# EasyEDA Pro project Dennis_Re.eprj, schematic 键盘主控板

## Sheets
1 c8t6: Create Date: 2023-03-26; Page Name: c8t6; Project Name: Dennis_Re; Schematic Name: 键盘主控板; Update Date: 2023-03-26; Company: 嘉立创EDA; Page Size: A4; Version: V1.0
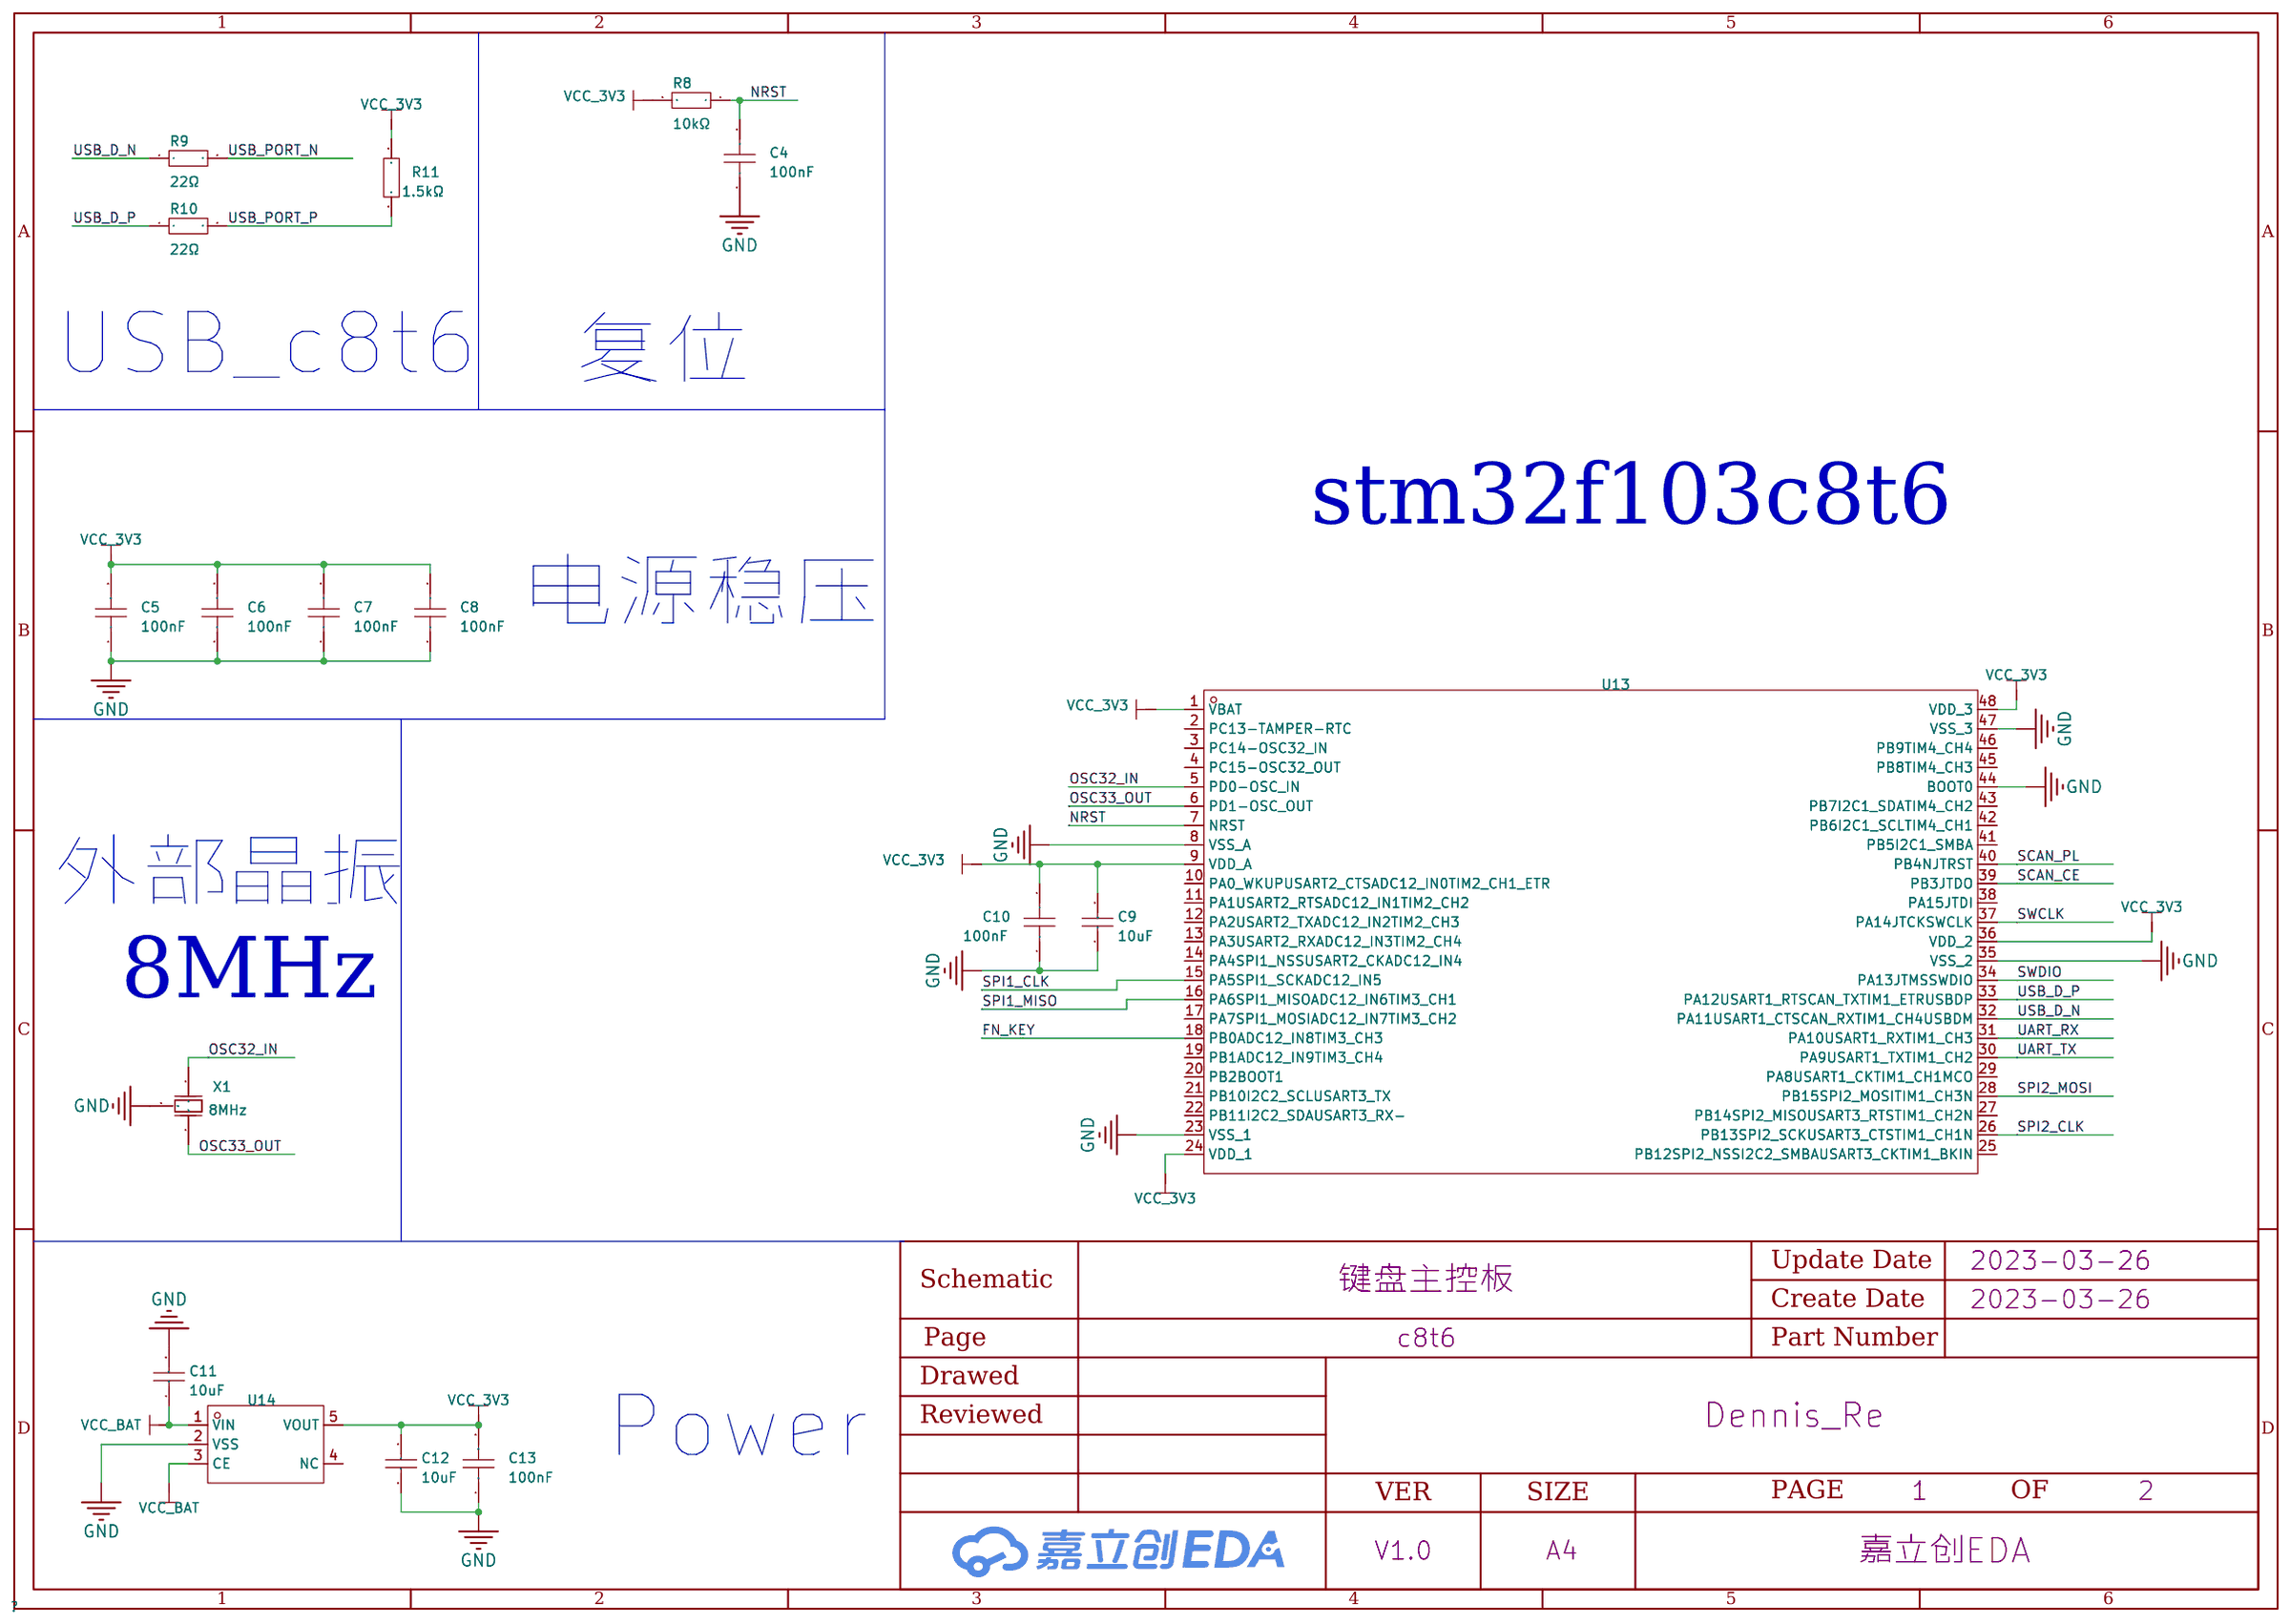
[diagram p0: c8t6]
2 hub: Page Name: hub; Update Date: 2023-03-28
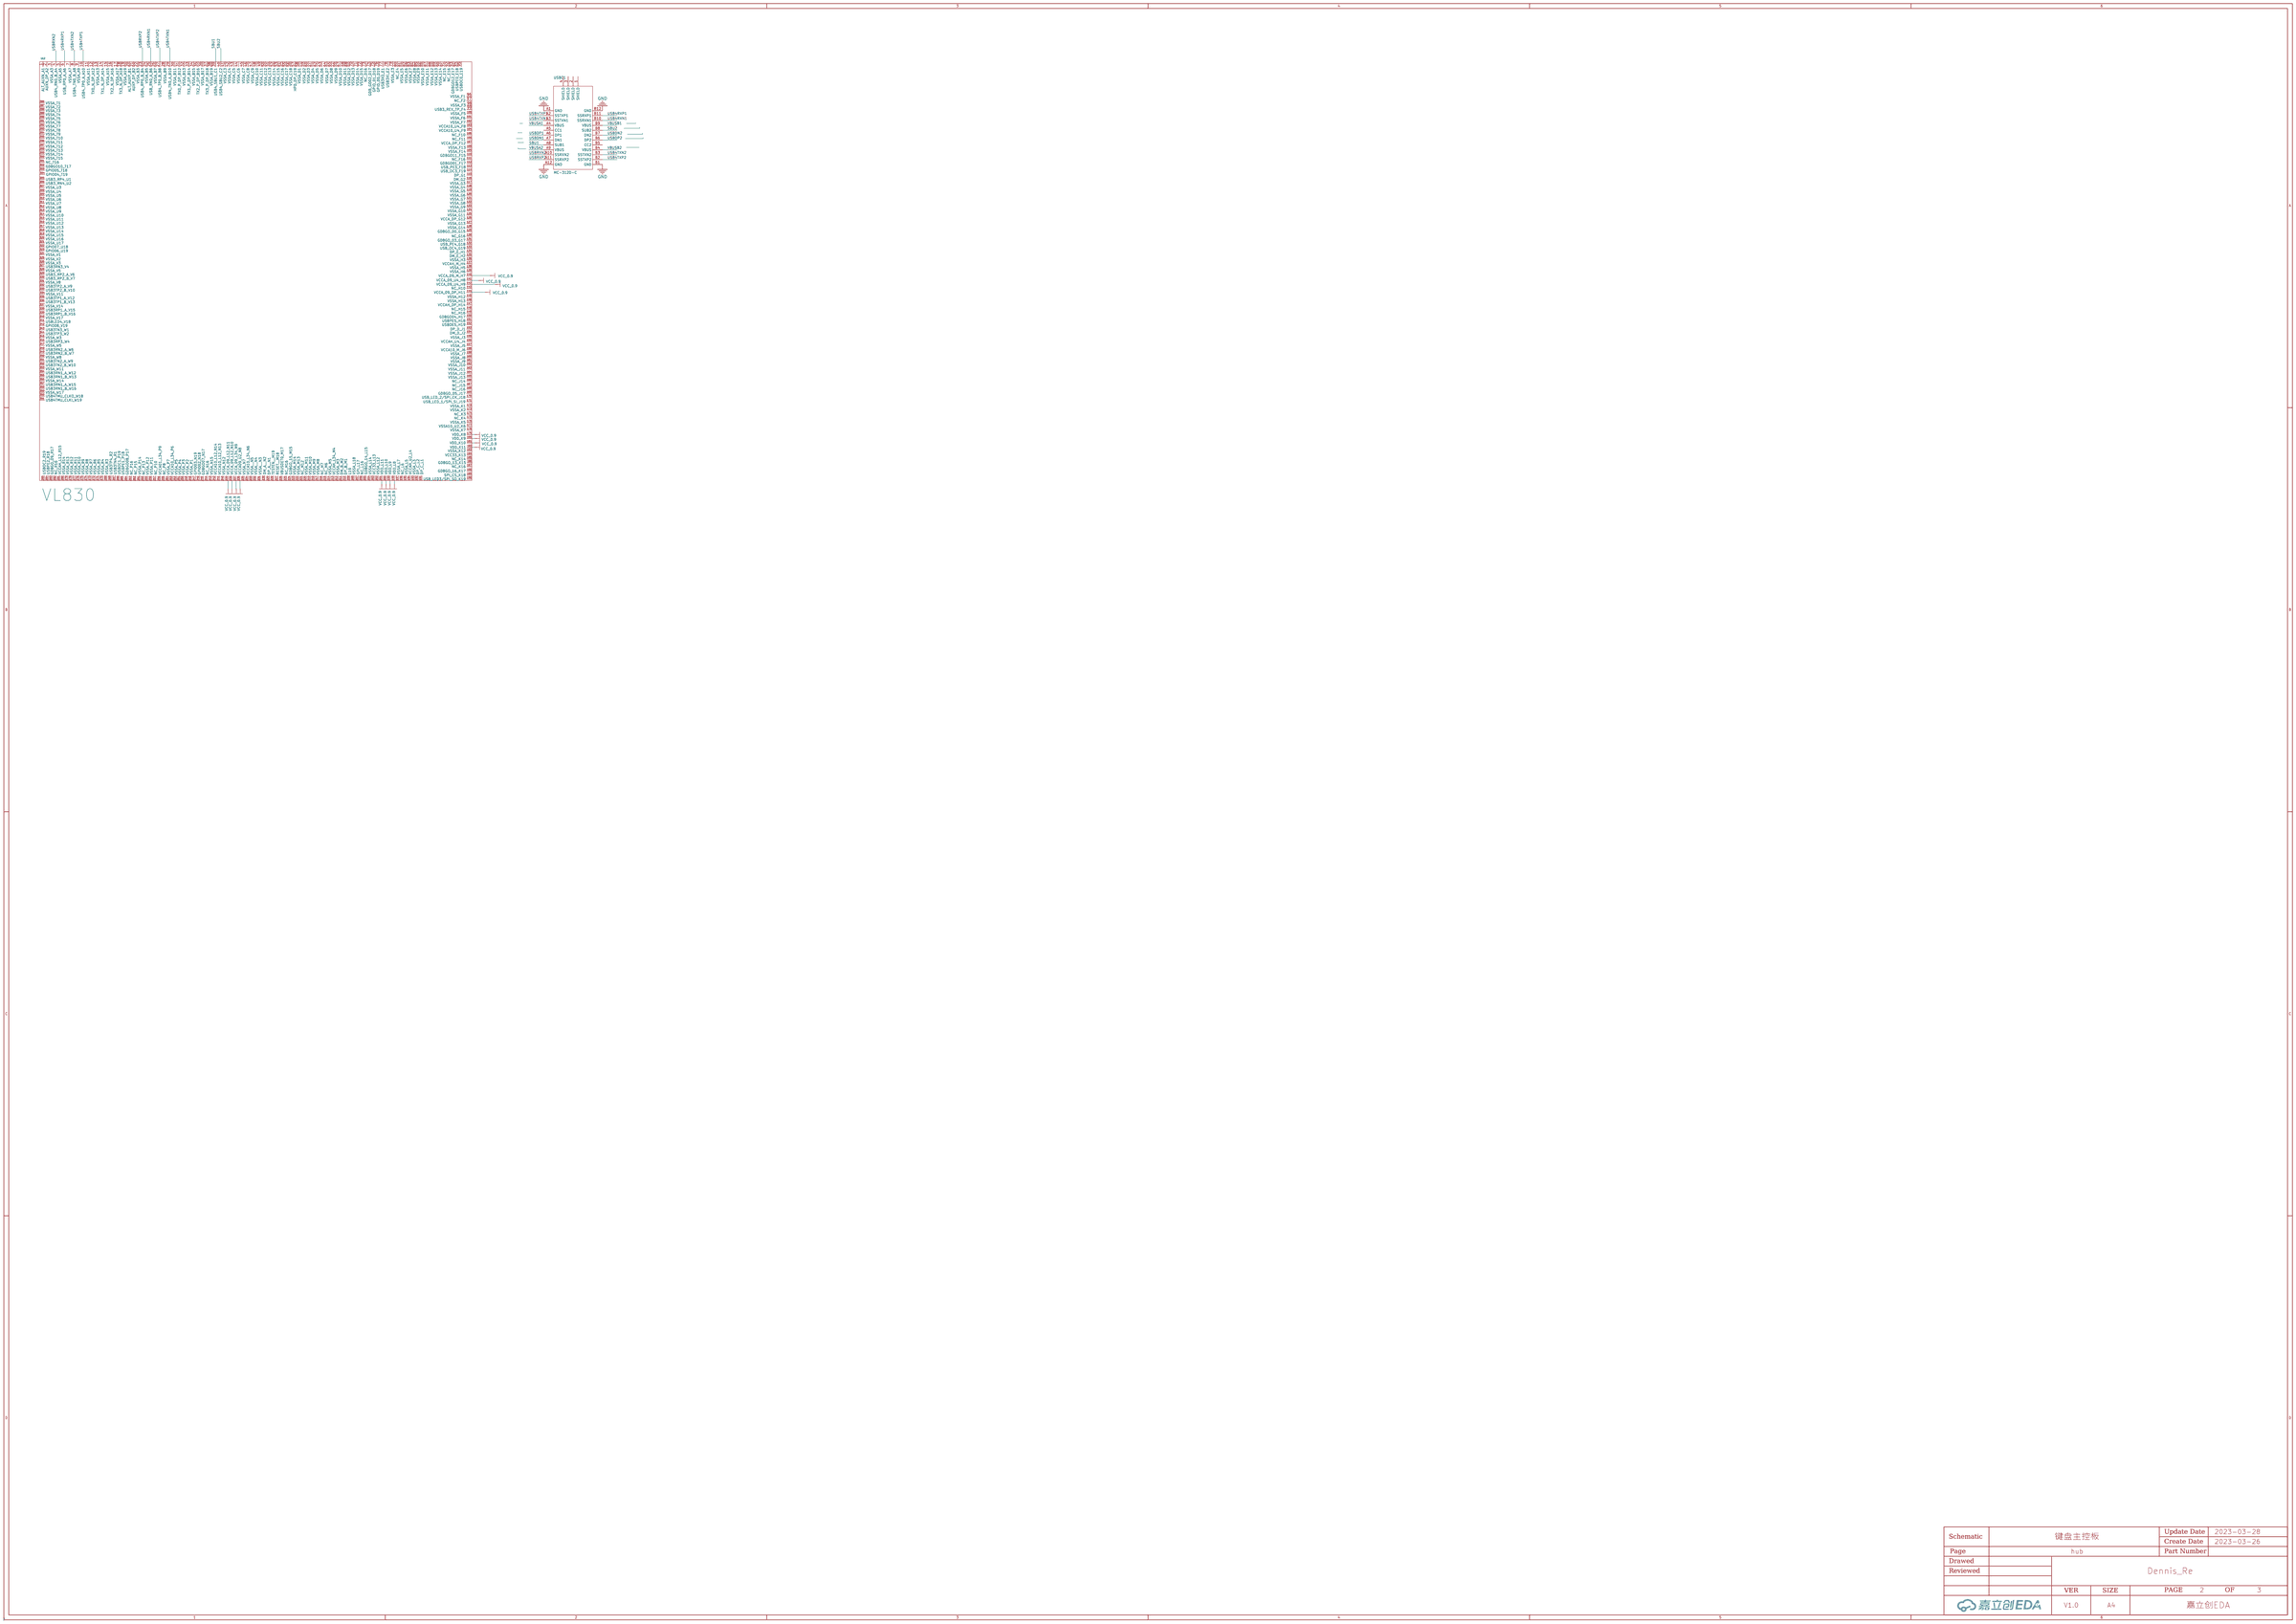
[diagram p1: hub]
3 key_control: Page Name: key_control; Update Date: 2023-03-28
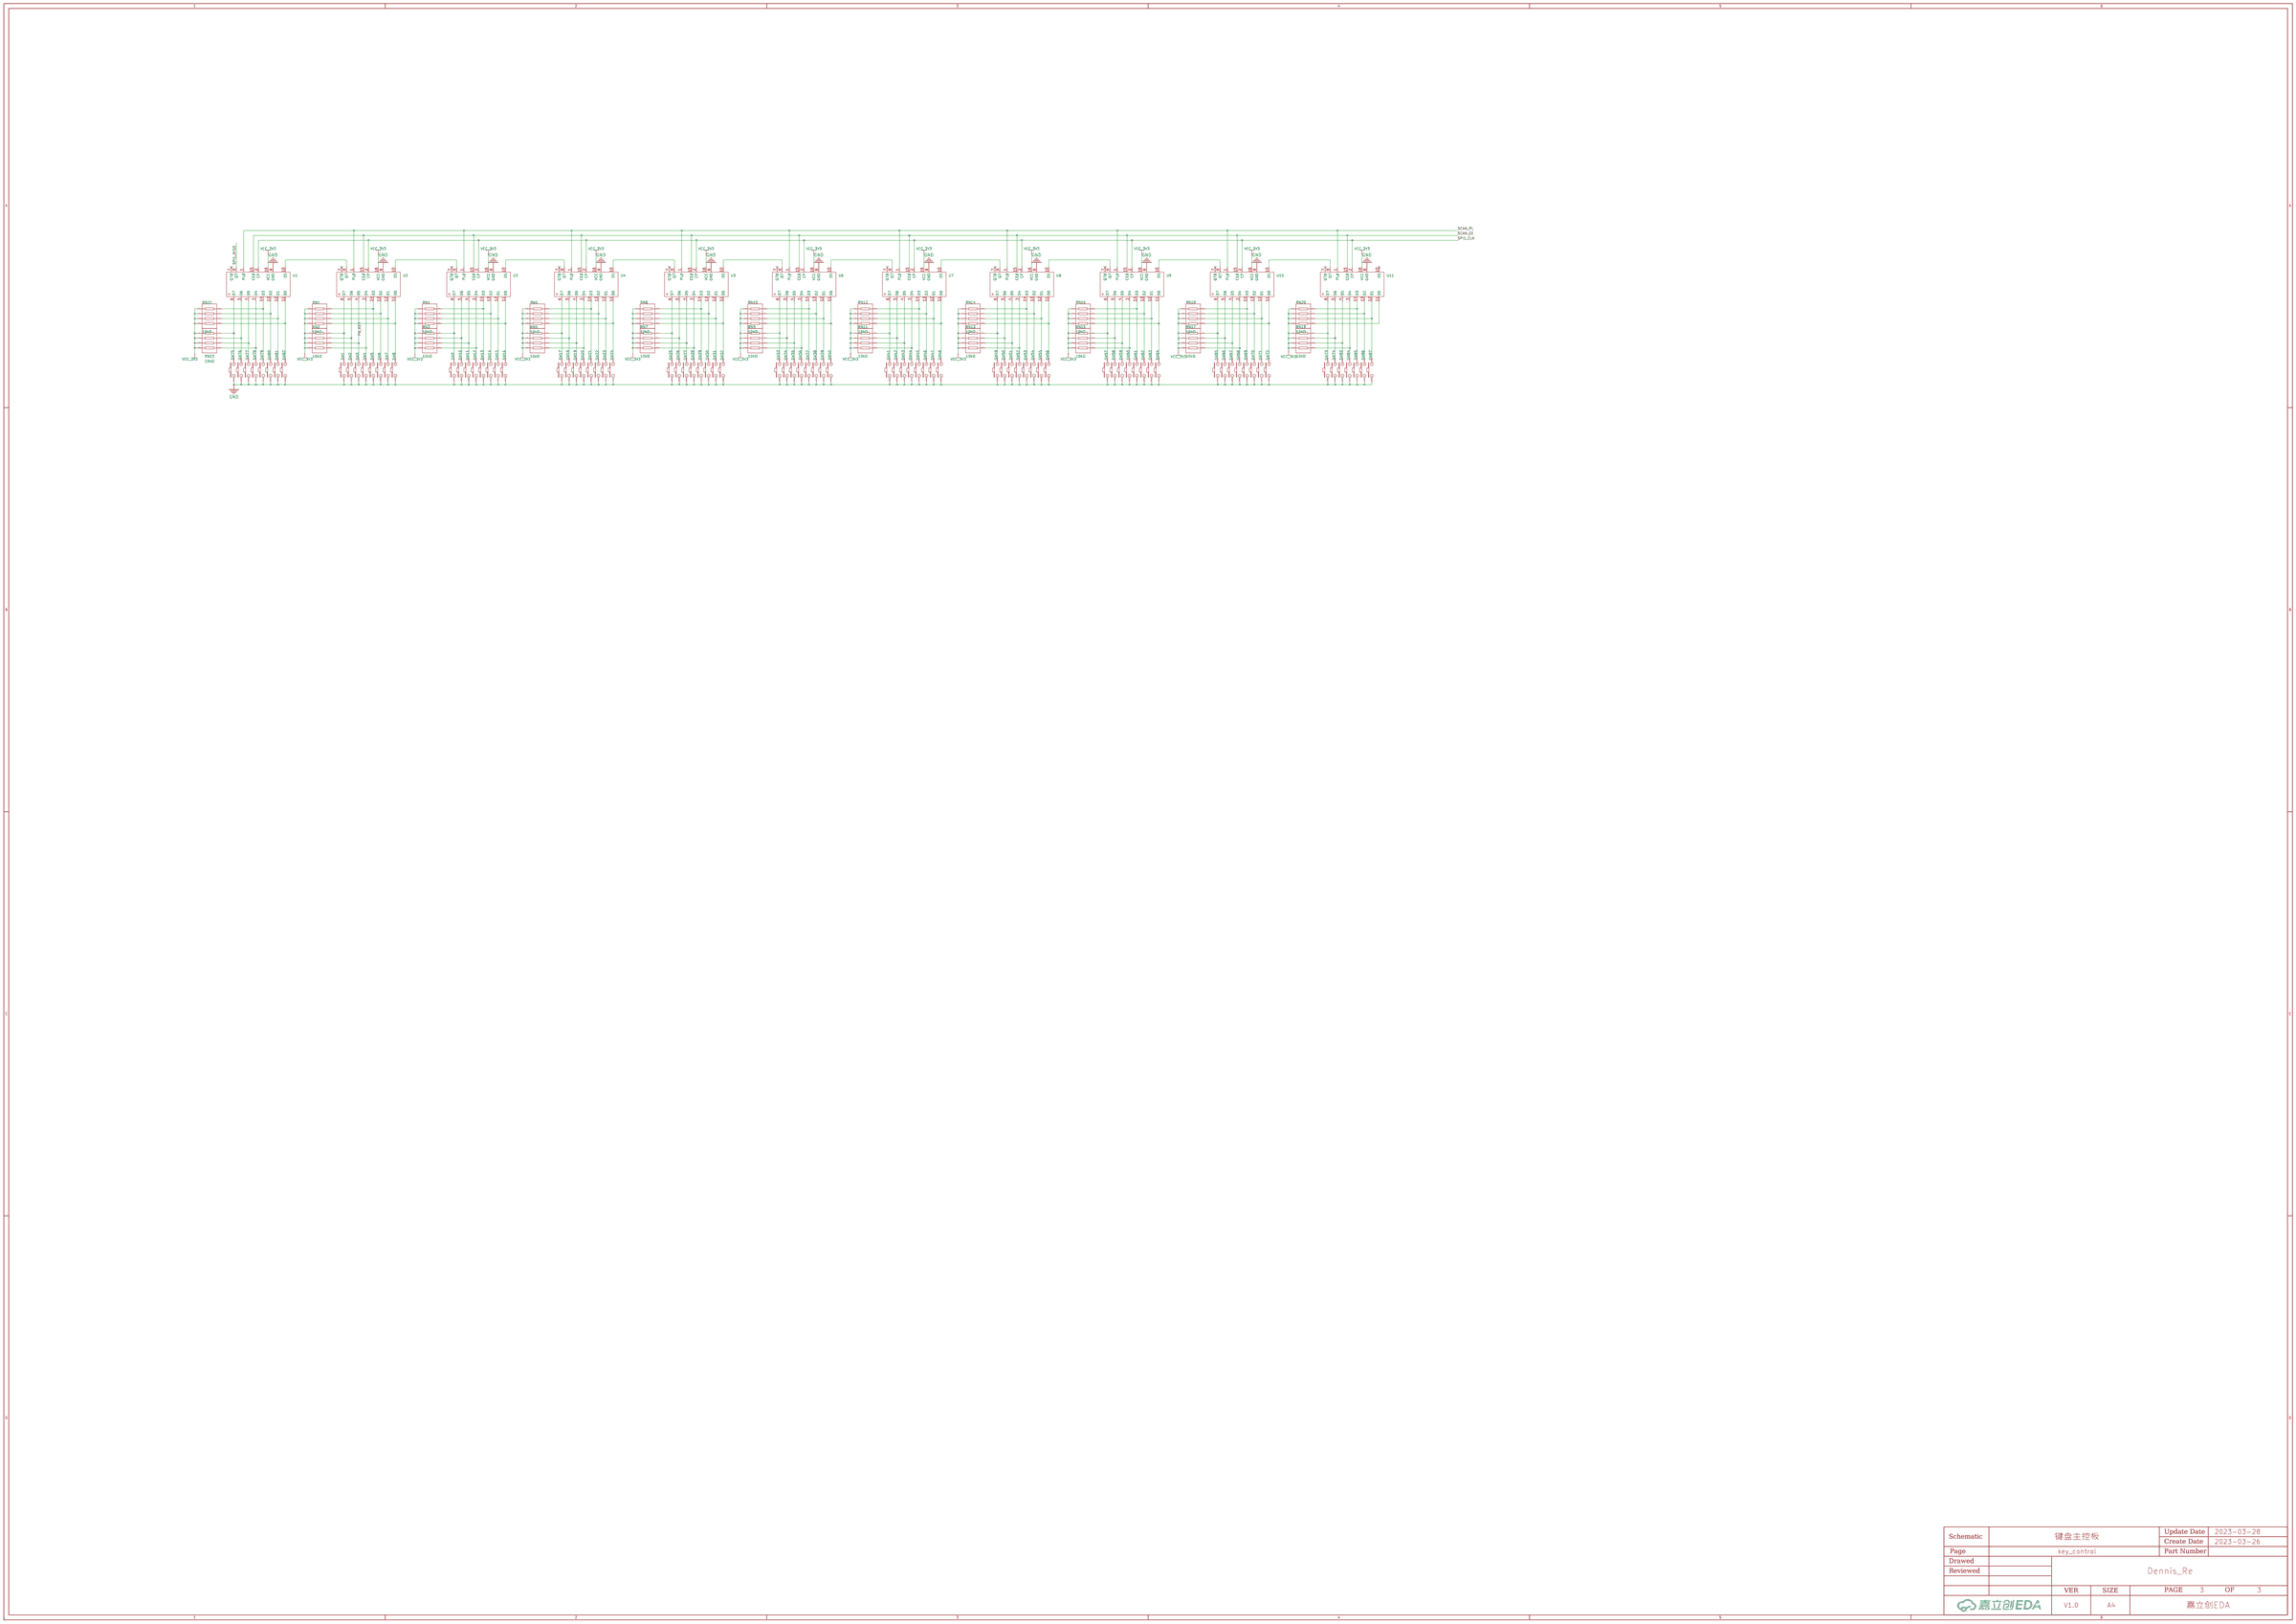
[diagram p2: key_control]

## Parts
sheet c8t6
C4  100nF  [C0402]
C5  100nF  [C0402]
C6  100nF  [C0402]
C7  100nF  [C0402]
C8  100nF  [C0402]
C9  10uF  [C0402]
C10  100nF  [C0402]
C11  10uF  [C0402]
C12  10uF  [C0402]
C13  100nF  [C0402]
R8  10kΩ  [R0402]
R9  22Ω  [R0402]
R10  22Ω  [R0402]
R11  1.5kΩ  [R0402]
U13  -  [LQFP-48_L7.0-W7.0-P0.50-LS9.0-BL]
U14  -  [SOT-25_L3.0-W1.6-P0.95-LS2.8-BL]
X1  8MHz  [OSC-SMD_3P-L3.2-W1.3-P1.20-L]
sheet hub
U12  VL830  [New_Library:VL830]
USBC1  MC-312D-C  [USB-C-SMD_MC-312D-C]
sheet key_control
RN1  10kΩ  [RES-ARRAY-SMD_0603-8P-L3.2-W1.6-BL]
RN2  10kΩ  [RES-ARRAY-SMD_0603-8P-L3.2-W1.6-BL]
RN3  10kΩ  [RES-ARRAY-SMD_0603-8P-L3.2-W1.6-BL]
RN4  10kΩ  [RES-ARRAY-SMD_0603-8P-L3.2-W1.6-BL]
RN5  10kΩ  [RES-ARRAY-SMD_0603-8P-L3.2-W1.6-BL]
RN6  10kΩ  [RES-ARRAY-SMD_0603-8P-L3.2-W1.6-BL]
RN7  10kΩ  [RES-ARRAY-SMD_0603-8P-L3.2-W1.6-BL]
RN8  10kΩ  [RES-ARRAY-SMD_0603-8P-L3.2-W1.6-BL]
RN9  10kΩ  [RES-ARRAY-SMD_0603-8P-L3.2-W1.6-BL]
RN10  10kΩ  [RES-ARRAY-SMD_0603-8P-L3.2-W1.6-BL]
RN11  10kΩ  [RES-ARRAY-SMD_0603-8P-L3.2-W1.6-BL]
RN12  10kΩ  [RES-ARRAY-SMD_0603-8P-L3.2-W1.6-BL]
RN13  10kΩ  [RES-ARRAY-SMD_0603-8P-L3.2-W1.6-BL]
RN14  10kΩ  [RES-ARRAY-SMD_0603-8P-L3.2-W1.6-BL]
RN15  10kΩ  [RES-ARRAY-SMD_0603-8P-L3.2-W1.6-BL]
RN16  10kΩ  [RES-ARRAY-SMD_0603-8P-L3.2-W1.6-BL]
RN17  10kΩ  [RES-ARRAY-SMD_0603-8P-L3.2-W1.6-BL]
RN18  10kΩ  [RES-ARRAY-SMD_0603-8P-L3.2-W1.6-BL]
RN19  10kΩ  [RES-ARRAY-SMD_0603-8P-L3.2-W1.6-BL]
RN20  10kΩ  [RES-ARRAY-SMD_0603-8P-L3.2-W1.6-BL]
RN21  10kΩ  [RES-ARRAY-SMD_0603-8P-L3.2-W1.6-BL]
RN22  10kΩ  [RES-ARRAY-SMD_0603-8P-L3.2-W1.6-BL]
SW1  -  [轴座_焊接热插拔_不带灯]
SW2  -  [轴座_焊接热插拔_不带灯]
SW3  -  [轴座_焊接热插拔_不带灯]
SW4  -  [轴座_焊接热插拔_不带灯]
SW5  -  [轴座_焊接热插拔_不带灯]
SW6  -  [轴座_焊接热插拔_不带灯]
SW7  -  [轴座_焊接热插拔_不带灯]
SW8  -  [轴座_焊接热插拔_不带灯]
SW9  -  [轴座_焊接热插拔_不带灯]
SW10  -  [轴座_焊接热插拔_不带灯]
SW11  -  [轴座_焊接热插拔_不带灯]
SW12  -  [轴座_焊接热插拔_不带灯]
SW13  -  [轴座_焊接热插拔_不带灯]
SW14  -  [轴座_焊接热插拔_不带灯]
SW15  -  [轴座_焊接热插拔_不带灯]
SW16  -  [轴座_焊接热插拔_不带灯]
SW17  -  [轴座_焊接热插拔_不带灯]
SW18  -  [轴座_焊接热插拔_不带灯]
SW19  -  [轴座_焊接热插拔_不带灯]
SW20  -  [轴座_焊接热插拔_不带灯]
SW21  -  [轴座_焊接热插拔_不带灯]
SW22  -  [轴座_焊接热插拔_不带灯]
SW23  -  [轴座_焊接热插拔_不带灯]
SW24  -  [轴座_焊接热插拔_不带灯]
SW25  -  [轴座_焊接热插拔_不带灯]
SW26  -  [轴座_焊接热插拔_不带灯]
SW27  -  [轴座_焊接热插拔_不带灯]
SW28  -  [轴座_焊接热插拔_不带灯]
SW29  -  [轴座_焊接热插拔_不带灯]
SW30  -  [轴座_焊接热插拔_不带灯]
SW31  -  [轴座_焊接热插拔_不带灯]
SW32  -  [轴座_焊接热插拔_不带灯]
SW33  -  [轴座_焊接热插拔_不带灯]
SW34  -  [轴座_焊接热插拔_不带灯]
SW35  -  [轴座_焊接热插拔_不带灯]
SW36  -  [轴座_焊接热插拔_不带灯]
SW37  -  [轴座_焊接热插拔_不带灯]
SW38  -  [轴座_焊接热插拔_不带灯]
SW39  -  [轴座_焊接热插拔_不带灯]
SW40  -  [轴座_焊接热插拔_不带灯]
SW41  -  [轴座_焊接热插拔_不带灯]
SW42  -  [轴座_焊接热插拔_不带灯]
SW43  -  [轴座_焊接热插拔_不带灯]
SW44  -  [轴座_焊接热插拔_不带灯]
SW45  -  [轴座_焊接热插拔_不带灯]
SW46  -  [轴座_焊接热插拔_不带灯]
SW47  -  [轴座_焊接热插拔_不带灯]
SW48  -  [轴座_焊接热插拔_不带灯]
SW49  -  [轴座_焊接热插拔_不带灯]
SW50  -  [轴座_焊接热插拔_不带灯]
SW51  -  [轴座_焊接热插拔_不带灯]
SW52  -  [轴座_焊接热插拔_不带灯]
SW53  -  [轴座_焊接热插拔_不带灯]
SW54  -  [轴座_焊接热插拔_不带灯]
SW55  -  [轴座_焊接热插拔_不带灯]
SW56  -  [轴座_焊接热插拔_不带灯]
SW57  -  [轴座_焊接热插拔_不带灯]
SW58  -  [轴座_焊接热插拔_不带灯]
SW59  -  [轴座_焊接热插拔_不带灯]
SW60  -  [轴座_焊接热插拔_不带灯]
SW61  -  [轴座_焊接热插拔_不带灯]
SW62  -  [轴座_焊接热插拔_不带灯]
SW63  -  [轴座_焊接热插拔_不带灯]
SW64  -  [轴座_焊接热插拔_不带灯]
SW65  -  [轴座_焊接热插拔_不带灯]
SW66  -  [轴座_焊接热插拔_不带灯]
SW67  -  [轴座_焊接热插拔_不带灯]
SW68  -  [轴座_焊接热插拔_不带灯]
SW69  -  [轴座_焊接热插拔_不带灯]
SW70  -  [轴座_焊接热插拔_不带灯]
SW71  -  [轴座_焊接热插拔_不带灯]
SW72  -  [轴座_焊接热插拔_不带灯]
SW73  -  [轴座_焊接热插拔_不带灯]
SW74  -  [轴座_焊接热插拔_不带灯]
SW75  -  [轴座_焊接热插拔_不带灯]
SW76  -  [轴座_焊接热插拔_不带灯]
SW77  -  [轴座_焊接热插拔_不带灯]
SW78  -  [轴座_焊接热插拔_不带灯]
SW79  -  [轴座_焊接热插拔_不带灯]
SW80  -  [轴座_焊接热插拔_不带灯]
SW81  -  [轴座_焊接热插拔_不带灯]
SW82  -  [轴座_焊接热插拔_不带灯]
SW83  -  [轴座_焊接热插拔_不带灯]
SW84  -  [轴座_焊接热插拔_不带灯]
SW85  -  [轴座_焊接热插拔_不带灯]
SW86  -  [轴座_焊接热插拔_不带灯]
SW87  -  [轴座_焊接热插拔_不带灯]
U1  -  [SOIC-16_L9.9-W3.9-P1.27-LS6.0-BL]
U2  -  [SOIC-16_L9.9-W3.9-P1.27-LS6.0-BL]
U3  -  [SOIC-16_L9.9-W3.9-P1.27-LS6.0-BL]
U4  -  [SOIC-16_L9.9-W3.9-P1.27-LS6.0-BL]
U5  -  [SOIC-16_L9.9-W3.9-P1.27-LS6.0-BL]
U6  -  [SOIC-16_L9.9-W3.9-P1.27-LS6.0-BL]
U7  -  [SOIC-16_L9.9-W3.9-P1.27-LS6.0-BL]
U8  -  [SOIC-16_L9.9-W3.9-P1.27-LS6.0-BL]
U9  -  [SOIC-16_L9.9-W3.9-P1.27-LS6.0-BL]
U10  -  [SOIC-16_L9.9-W3.9-P1.27-LS6.0-BL]
U11  -  [SOIC-16_L9.9-W3.9-P1.27-LS6.0-BL]

## Library data of the parts
C4-C8 C10 C13 = CL05B104KB54PNC: 容值:100nF;精度:±10%;额定电压:50V;温度系数:X7R;; LCSC Part Name: 100nF ±10% 50V; Supplier Part: C307331; Manufacturer: SAMSUNG(三星); Supplier Footprint: 0402; Datasheet: https://atta.szlcsc.com/upload/public/pdf/source/20181009/C307331_222F7C870FD3EA5F46F538B483443886.pdf; Supplier: LCSC; Tolerance: ±10%; Voltage Rated: 50V; Temperature Coefficient: X7R
C9 C11 C12 = CL05A106MQ5NUNC: 容值:10uF;精度:±20%;额定电压:6.3V;温度系数:X5R;; LCSC Part Name: 10uF ±20% 6.3V; Supplier Part: C15525; Manufacturer: SAMSUNG(三星); Supplier Footprint: 0402; Datasheet: https://atta.szlcsc.com/upload/public/pdf/source/20160103/1457707676445.pdf; Supplier: LCSC; Tolerance: ±20%; Voltage Rated: 6.3V; Temperature Coefficient: X5R
R8 = 0402WGF1002TCE: 电阻类型:厚膜电阻;阻值:10kΩ;精度:±1%;功率:62.5mW;温度系数:±100ppm/;最大工作电压:50V;工作温度范围:-55~+155;; LCSC Part Name: 10kΩ ±1% 62.5mW; Supplier Part: C25744; Manufacturer: UNI-ROYAL(厚声); Supplier Footprint: 0402; Datasheet: https://atta.szlcsc.com/upload/public/pdf/source/20200306/C422600_1E6D84923E4A46A82E41ADD87F860B5C.pdf; Supplier: LCSC; Type: 厚膜电阻; Tolerance: ±1%; Power(Watts): 62.5mW; Temperature Coefficient: ±100ppm/; Overload Voltage (Max): 50V; Operating Temperature Range: -55~+155
R9 R10 = 0402WGF220JTCE: 电阻类型:厚膜电阻;阻值:22Ω;精度:±1%;功率:62.5mW;温度系数:±200ppm/;最大工作电压:50V;工作温度范围:-55~+155;; LCSC Part Name: 22Ω ±1% 62.5mW; Supplier Part: C25092; Manufacturer: UNI-ROYAL(厚声); Supplier Footprint: 0402; Datasheet: https://atta.szlcsc.com/upload/public/pdf/source/20200306/C422600_1E6D84923E4A46A82E41ADD87F860B5C.pdf; Supplier: LCSC; Type: 厚膜电阻; Tolerance: ±1%; Power(Watts): 62.5mW; Temperature Coefficient: ±200ppm/; Overload Voltage (Max): 50V; Operating Temperature Range: -55~+155
R11 = 0402WGF1501TCE: 阻值:1.5kΩ;精度:±1%;功率:1/16W;温度系数:±100ppm/;最大工作电压:50V;工作温度范围:-55~+155;; LCSC Part Name: 1.5KΩ ±1%; Supplier Part: C25867; Manufacturer: UNI-ROYAL(厚声); Supplier Footprint: 0402; Datasheet: https://atta.szlcsc.com/upload/public/pdf/source/20170920/C25867_1505895090394980874.pdf; Supplier: LCSC; Tolerance: ±1%; Power(Watts): 1/16W; Temperature Coefficient: ±100ppm/; Overload Voltage (Max): 50V; Operating Temperature Range: -55~+155
U13 = STM32F103CBT6: 主频（MAX):72MHz;工作电压:2V ~ 3.6V;; Supplier Part: C8304; Manufacturer: ST(意法半导体); Supplier Footprint: LQFP-48_7x7x05P; Datasheet: https://atta.szlcsc.com/upload/public/pdf/source/20140724/1457707170379.pdf; Supplier: LCSC; Speed: 72MHz; Voltage - Supply (Vcc/Vdd): 2V ~ 3.6V; RAM Size: 20KB; Number of I/O: 37; A/D: 16x12bit; PWM: 13; UART/USART: 3 USART; I2C（SMBUS/PMBUS）: 2; USB Device: 1; CAN: 1
U14 = XC6210B332MR: 输出类型:固定;输出极性:正;输出通道数:1;最大输入电压:6V;输出电压:3.3V;压差:75mV@(100mA);输出电流:900mA;电源纹波抑制比(PRSS):60dB@(1kHz);; LCSC Part Name: Vin=6V Vout=3.3V 900mA 60dB@(1kHz); Supplier Part: C424705; Manufacturer: TOREX(特瑞仕); Supplier Footprint: SOT-25; Datasheet: https://atta.szlcsc.com/upload/public/pdf/source/20190903/C424705_1DFB2113A9A78D399905DBF688657204.pdf; Supplier: LCSC; Output Type: 固定; Output Polarity: 正; Number of Outputs: 1; Maximum Input Voltage: 6V; Output Voltage: 3.3V; Dropout Voltage: 75mV@(100mA); Output Current: 900mA; Power Supply Rejection Ratio (PRSS): 60dB@(1kHz)
X1 = CSTNE8M00GH5C000R0: 频率:8MHz;频率容差:±0.07%;内藏负载电容:33pF;谐振阻抗:40Ω;; LCSC Part Name: 8MHz ±0.07% 33pF; Supplier Part: C341525; Manufacturer: muRata(村田); Supplier Footprint: SMD3213-3P; Datasheet: https://atta.szlcsc.com/upload/public/pdf/source/20181211/C341525_832BA077079E4863A5153C1DB98581D5.pdf; Supplier: LCSC; Frequency Stability: ±0.13%; Frequency Tolerance: ±0.07%; Built-in Load Capacitance: 33pF; Resonant Impedance: 40Ω; Operating Temperature: -40~+125
U12 = New_Library_VL830
USBC1 = MC-312D-C: 连接器类型:Type-C;标准:-;公母:母座;触点数量:24;端口数量:1;; LCSC Part Name: Type-C 母座; Supplier Part: C183607; Manufacturer: SOFNG(硕方); Supplier Footprint: SMD; JLCPCB Part Class: Extended Part; Datasheet: https://atta.szlcsc.com/upload/public/pdf/source/20211102/FA3D1694F2603818E0C729EA0D884A74.pdf; Supplier: LCSC; Connector Type: Type-C; Gender: 母座; Number of Contacts: 24; Number of Ports: 1
RN1-RN21 = 4D03WGJ0103T5E: 阻值:10kΩ;精度:±5%;单个元件功率:62.5mW;温度系数:±200ppm/;电阻器数:4;引脚数:8;; LCSC Part Name: 10kΩ ±5%; Supplier Part: C29718; Manufacturer: UNI-ROYAL(厚声); Supplier Footprint: 0603x4; Datasheet: https://atta.szlcsc.com/upload/public/pdf/source/20170615/1497511005633.pdf; Supplier: LCSC; Tolerance: ±5%; Power(Watts): 62.5mW; Temperature Coefficient: ±200ppm/; Number of Resistors: 4; Number of Pins: 8
RN22 = 4D03WGJ0103T5E: 阻值:10kΩ;精度:±5%;单个元件功率:62.5mW;温度系数:±200ppm/℃;电阻器数:4;引脚数:8;; LCSC Part Name: 10kΩ ±5%; Supplier Part: C29718; Manufacturer: UNI-ROYAL(厚声); Supplier Footprint: 0603x4; Datasheet: https://atta.szlcsc.com/upload/public/pdf/source/20170615/1497511005633.pdf; Supplier: LCSC; Tolerance: ±5%; Power(Watts): 62.5mW; Temperature Coefficient: ±200ppm/℃; Number of Resistors: 4; Number of Pins: 8
SW1-SW87 = KEYBOARD-SW: Origin Footprint 2: MX-KEY
U1-U11 = 74HC165D,653: Supplier Part: C5613; Manufacturer: Nexperia(安世); Supplier Footprint: SOIC-16_150mil; Datasheet: https://atta.szlcsc.com/upload/public/pdf/source/20160218/1457707760975.pdf; Supplier: LCSC

## Nets
GND: C4.1 C5.1 C6.1 C7.1 C8.1 C9.1 C10.1 C11.2 C12.1 C13.1 SW1.1 SW2.1 SW3.1 SW4.1 SW5.1 SW6.1 SW7.1 SW8.1 SW9.1 SW10.1 SW11.1 SW12.1 SW13.1 SW14.1 SW15.1 SW16.1 SW17.1 SW18.1 SW19.1 SW20.1 SW21.1 SW22.1 SW23.1 SW24.1 SW25.1 SW26.1 SW27.1 SW28.1 SW29.1 SW30.1 SW31.1 SW32.1 SW33.1 SW34.1 SW35.1 SW36.1 SW37.1 SW38.1 SW39.1 SW40.1 SW41.1 SW42.1 SW43.1 SW44.1 SW45.1 SW46.1 SW47.1 SW48.1 SW49.1 SW50.1 SW51.1 SW52.1 SW53.1 SW54.1 SW55.1 SW56.1 SW57.1 SW58.1 SW59.1 SW60.1 SW61.1 SW62.1 SW63.1 SW64.1 SW65.1 SW66.1 SW67.1 SW68.1 SW69.1 SW70.1 SW71.1 SW72.1 SW73.1 SW74.1 SW75.1 SW76.1 SW77.1 SW78.1 SW79.1 SW80.1 SW81.1 SW82.1 SW83.1 SW84.1 SW85.1 SW86.1 SW87.1 U1.8(GND) U2.8(GND) U3.8(GND) U4.8(GND) U5.8(GND) U6.8(GND) U7.8(GND) U8.8(GND) U9.8(GND) U10.8(GND) U11.8(GND) U13.8(VSS_A) U13.23(VSS_1) U13.35(VSS_2) U13.44(BOOT0) U13.47(VSS_3) U14.2(VSS) USBC1.A1(GND) USBC1.A12(GND) USBC1.B1(GND) USBC1.B12(GND) X1.2(GND)
VBUSA1: USBC1.A4(VBUS)
VBUSA2: USBC1.A9(VBUS)
VBUSB1: USBC1.B9(VBUS)
VBUSB2: USBC1.B4(VBUS)
VCC_0.9: U12.140(VCCA_09_M_H7) U12.141(VCCA_09_U4_H8) U12.142(VCCA_09_U4_H9) U12.144(VCCA_09_DP_H11) U12.179(VDD_K8) U12.180(VDD_K9) U12.181(VDD_K10) U12.182(VDD_K11) U12.198(VDD_L8) U12.199(VDD_L9) U12.200(VDD_L10) U12.201(VDD_L11) U12.236(VCCA09_U2_N8) U12.237(VCCA_09_L34_N9) U12.238(VCCA_09_L12_N10) U12.239(VCCA_09_L12_N11)
VCC_3V3: C5.2 C6.2 C7.2 C8.2 C9.2 C10.2 C12.2 C13.2 R8.2 R11.2 RN1.5 RN1.6 RN1.7 RN1.8 RN2.5 RN2.6 RN2.7 RN2.8 RN3.1 RN3.2 RN3.3 RN3.4 RN4.1 RN4.2 RN4.3 RN4.4 RN5.1 RN5.2 RN5.3 RN5.4 RN6.1 RN6.2 RN6.3 RN6.4 RN7.1 RN7.2 RN7.3 RN7.4 RN8.1 RN8.2 RN8.3 RN8.4 RN9.1 RN9.2 RN9.3 RN9.4 RN10.1 RN10.2 RN10.3 RN10.4 RN11.1 RN11.2 RN11.3 RN11.4 RN12.1 RN12.2 RN12.3 RN12.4 RN13.1 RN13.2 RN13.3 RN13.4 RN14.1 RN14.2 RN14.3 RN14.4 RN15.1 RN15.2 RN15.3 RN15.4 RN16.1 RN16.2 RN16.3 RN16.4 RN17.1 RN17.2 RN17.3 RN17.4 RN18.1 RN18.2 RN18.3 RN18.4 RN19.1 RN19.2 RN19.3 RN19.4 RN20.1 RN20.2 RN20.3 RN20.4 RN21.1 RN21.2 RN21.3 RN21.4 RN22.5 RN22.6 RN22.7 RN22.8 U1.16(VCC) U2.16(VCC) U3.16(VCC) U4.16(VCC) U5.16(VCC) U6.16(VCC) U7.16(VCC) U8.16(VCC) U9.16(VCC) U10.16(VCC) U11.16(VCC) U13.1(VBAT) U13.9(VDD_A) U13.24(VDD_1) U13.36(VDD_2) U13.48(VDD_3) U14.5(VOUT)
VCC_BAT: C11.1 U14.1(VIN) U14.3(CE)
FN_KEY: RN2.3 SW3.2 U2.4(D5) U13.18(PB0ADC12_IN8TIM3_CH3)
NRST: C4.2 R8.1 U13.7(NRST)
OSC32_IN: U13.5(PD0-OSC_IN) X1.3(OSC2)
OSC33_OUT: U13.6(PD1-OSC_OUT) X1.1(OSC1)
SBU1: U12.39(USB4_SBU1_C1) USBC1.A8(SUB1)
SBU2: U12.40(USB4_SBU2_C2) USBC1.B8(SUB2)
SCAN_CE: U1.15(CE#) U2.15(CE#) U3.15(CE#) U4.15(CE#) U5.15(CE#) U6.15(CE#) U7.15(CE#) U8.15(CE#) U9.15(CE#) U10.15(CE#) U11.15(CE#) U13.39(PB3JTDO)
SCAN_PL: U1.1(PL#) U2.1(PL#) U3.1(PL#) U4.1(PL#) U5.1(PL#) U6.1(PL#) U7.1(PL#) U8.1(PL#) U9.1(PL#) U10.1(PL#) U11.1(PL#) U13.40(PB4NJTRST)
SPI1_CLK: U1.2(CP) U2.2(CP) U3.2(CP) U4.2(CP) U5.2(CP) U6.2(CP) U7.2(CP) U8.2(CP) U9.2(CP) U10.2(CP) U11.2(CP) U13.15(PA5SPI1_SCKADC12_IN5)
SPI1_MISO: U1.9(Q7) U13.16(PA6SPI1_MISOADC12_IN6TIM3_CH1)
SPI2_CLK: U13.26(PB13SPI2_SCKUSART3_CTSTIM1_CH1N)
SPI2_MOSI: U13.28(PB15SPI2_MOSITIM1_CH3N)
SWCLK: U13.37(PA14JTCKSWCLK)
SWDIO: U13.34(PA13JTMSSWDIO)
UART_RX: U13.31(PA10USART1_RXTIM1_CH3)
UART_TX: U13.30(PA9USART1_TXTIM1_CH2)
USB4RXN1: U12.25(USB_RN0_A_B6) USBC1.B10(SSRXN1)
USB4RXP1: U12.6(USB_RP0_A_A6) USBC1.B11(SSRXP1)
USB4TXN1: U12.29(USB4_TN0_A_B10) USBC1.A3(SSTXN1)
USB4TXN2: U12.8(USB4_TN0_B_A8) USBC1.B3(SSTXN2)
USB4TXP1: U12.10(USB4_TP0_A_A10) USBC1.A2(SSTXP1)
USB4TXP2: U12.27(USB4_TP0_B_B8) USBC1.B2(SSTXP2)
USB_D_N: R9.1 U13.32(PA11USART1_CTSCAN_RXTIM1_CH4USBDM)
USB_D_P: R10.1 U13.33(PA12USART1_RTSCAN_TXTIM1_ETRUSBDP)
USB_PORT_N: R9.2
USB_PORT_P: R10.2 R11.1
USBDN1: USBC1.A7(DN1)
USBDN2: USBC1.B7(DN2)
USBDP1: USBC1.A6(DP1)
USBDP2: USBC1.B6(DP2)
USBRXN2: U12.4(USB4_RN0_B_A4) USBC1.A10(SSRXN2)
USBRXP2: U12.23(USB4_RP0_B_B4) USBC1.A11(SSRXP2)
$3N18307: RN2.1 SW1.2 U2.6(D7)
$3N18308: RN2.2 SW2.2 U2.5(D6)
$3N18310: RN2.4 SW4.2 U2.3(D4)
$3N18311: RN1.4 SW8.2 U2.11(D0)
$3N18312: RN1.1 SW5.2 U2.14(D3)
$3N18313: RN1.2 SW6.2 U2.13(D2)
$3N18314: RN1.3 SW7.2 U2.12(D1)
$3N18320: RN7.5 SW25.2 U5.6(D7)
$3N18321: RN7.6 SW26.2 U5.5(D6)
$3N18322: RN7.7 SW27.2 U5.4(D5)
$3N18323: RN7.8 SW28.2 U5.3(D4)
$3N18324: RN8.8 SW32.2 U5.11(D0)
$3N18325: RN8.5 SW29.2 U5.14(D3)
$3N18326: RN8.6 SW30.2 U5.13(D2)
$3N18327: RN8.7 SW31.2 U5.12(D1)
$3N18332: RN13.5 SW49.2 U8.6(D7)
$3N18333: RN13.6 SW50.2 U8.5(D6)
$3N18334: RN13.7 SW51.2 U8.4(D5)
$3N18335: RN13.8 SW52.2 U8.3(D4)
$3N18336: RN14.8 SW56.2 U8.11(D0)
$3N18337: RN14.5 SW53.2 U8.14(D3)
$3N18338: RN14.6 SW54.2 U8.13(D2)
$3N18339: RN14.7 SW55.2 U8.12(D1)
$3N18343: RN15.5 SW57.2 U9.6(D7)
$3N18344: RN15.6 SW58.2 U9.5(D6)
$3N18345: RN15.7 SW59.2 U9.4(D5)
$3N18346: RN15.8 SW60.2 U9.3(D4)
$3N18347: RN16.8 SW64.2 U9.11(D0)
$3N18348: RN16.5 SW61.2 U9.14(D3)
$3N18349: RN16.6 SW62.2 U9.13(D2)
$3N18350: RN16.7 SW63.2 U9.12(D1)
$3N18354: RN17.5 SW65.2 U10.6(D7)
$3N18355: RN17.6 SW66.2 U10.5(D6)
$3N18356: RN17.7 SW67.2 U10.4(D5)
$3N18357: RN17.8 SW68.2 U10.3(D4)
$3N18358: RN18.8 SW72.2 U10.11(D0)
$3N18359: RN18.5 SW69.2 U10.14(D3)
$3N18360: RN18.6 SW70.2 U10.13(D2)
$3N18361: RN18.7 SW71.2 U10.12(D1)
$3N18373: RN4.7 SW15.2 U3.12(D1)
$3N18374: RN4.6 SW14.2 U3.13(D2)
$3N18375: RN4.5 SW13.2 U3.14(D3)
$3N18376: RN4.8 SW16.2 U3.11(D0)
$3N18377: RN3.8 SW12.2 U3.3(D4)
$3N18378: RN3.7 SW11.2 U3.4(D5)
$3N18379: RN3.6 SW10.2 U3.5(D6)
$3N18380: RN3.5 SW9.2 U3.6(D7)
$3N18384: RN12.7 SW47.2 U7.12(D1)
$3N18385: RN12.6 SW46.2 U7.13(D2)
$3N18386: RN12.5 SW45.2 U7.14(D3)
$3N18387: RN12.8 SW48.2 U7.11(D0)
$3N18388: RN11.8 SW44.2 U7.3(D4)
$3N18389: RN11.7 SW43.2 U7.4(D5)
$3N18390: RN11.6 SW42.2 U7.5(D6)
$3N18391: RN11.5 SW41.2 U7.6(D7)
$3N18394: RN10.6 SW38.2 U6.13(D2)
$3N18395: RN10.8 SW40.2 U6.11(D0)
$3N18396: RN9.8 SW36.2 U6.3(D4)
$3N18397: RN9.6 SW34.2 U6.5(D6)
$3N18398: RN10.5 SW37.2 U6.14(D3)
$3N18399: RN10.7 SW39.2 U6.12(D1)
$3N18400: RN9.7 SW35.2 U6.4(D5)
$3N18401: RN9.5 SW33.2 U6.6(D7)
$3N18402: U2.10(DS) U3.9(Q7)
$3N18403: U3.10(DS) U4.9(Q7)
$3N18404: U4.10(DS) U5.9(Q7)
$3N18405: U5.10(DS) U6.9(Q7)
$3N18406: U6.10(DS) U7.9(Q7)
$3N18407: U7.10(DS) U8.9(Q7)
$3N18408: U8.10(DS) U9.9(Q7)
$3N18409: U9.10(DS) U10.9(Q7)
$3N18410: U10.10(DS) U11.9(Q7)
$3N18411: RN21.8 SW82.2 U1.11(D0)
$3N18412: RN21.5 SW79.2 U1.14(D3)
$3N18413: RN21.6 SW80.2 U1.13(D2)
$3N18414: RN21.7 SW81.2 U1.12(D1)
$3N18417: U1.10(DS) U2.9(Q7)
$3N18444: RN22.4 SW78.2 U1.3(D4)
$3N18445: RN22.3 SW77.2 U1.4(D5)
$3N18446: RN22.2 SW76.2 U1.5(D6)
$3N18447: RN22.1 SW75.2 U1.6(D7)
$3N18449: RN5.8 SW20.2 U4.3(D4)
$3N18450: RN5.7 SW19.2 U4.4(D5)
$3N18451: RN5.6 SW18.2 U4.5(D6)
$3N18452: RN5.5 SW17.2 U4.6(D7)
$3N18453: RN6.7 SW23.2 U4.12(D1)
$3N18454: RN6.6 SW22.2 U4.13(D2)
$3N18455: RN6.5 SW21.2 U4.14(D3)
$3N18456: RN6.8 SW24.2 U4.11(D0)
$3N34287: RN19.5 SW73.2 U11.6(D7)
$3N34288: RN19.6 SW74.2 U11.5(D6)
$3N34289: RN19.7 SW83.2 U11.4(D5)
$3N34290: RN19.8 SW84.2 U11.3(D4)
$3N34291: RN20.8 U11.11(D0)
$3N34292: RN20.5 SW85.2 U11.14(D3)
$3N34293: RN20.6 SW86.2 U11.13(D2)
$3N34294: RN20.7 SW87.2 U11.12(D1)

Not connected (* = marked no-connect by the designer): U1 7(Q7#)*; U2 7(Q7#)*; U3 7(Q7#)*; U4 7(Q7#)*; U5 7(Q7#)*; U6 7(Q7#)*; U7 7(Q7#)*; U8 7(Q7#)*; U9 7(Q7#)*; U10 7(Q7#)*; U11 7(Q7#)* 10(DS)*; U12 1(ALT_AUXN_A1) 2(AUXN_DP_A2) 3(VSSA_A3) 5(VSSA_A5) 7(VSSA_A7) 9(VSSA_A9) 11(VSSA_A11) 12(TX0_N_DP_A12) 13(VSSA_A13) 14(TX1_N_DP_A14) 15(VSSA_A15) 16(TX2_N_DP_A16) 17(VSSA_A17) 18(TX3_N_DP_A18) 19(VSSA_A19) 20(ALT_AUXP_B1) 21(AUXP_DP_B2) 22(VSSA_B3) 24(VSSA_B5) 26(VSSA_B7) 28(VSSA_B9) 30(VSSA_B11) 31(TX0_P_DP_B12) 32(VSSA_B13) 33(TX1_P_DP_B14) 34(VSSA_B15) 35(TX2_P_DP_B16) 36(VSSA_B17) 37(TX3_P_DP_B18) 38(VSSA_B19) 41(VSSA_C3) 42(VSSA_C4) 43(VSSA_C5) 44(VSSA_C6) 45(VSSA_C7) 46(VSSA_C8) 47(VSSA_C9) 48(VSSA_C10) 49(VSSA_C11) 50(VSSA_C12) 51(VSSA_C13) 52(VSSA_C14) 53(VSSA_C15) 54(VSSA_C16) 55(VSSA_C17) 56(VSSA_C18) 57(HPD_DP_C19) 58(VSSA_D1) 59(VSSA_D2) 60(VSSA_D3) 61(VSSA_D4) 62(VSSA_D5) 63(VSSA_D6) 64(VSSA_D7) 65(VSSA_D8) 66(VSSA_D9) 67(VSSA_D10) 68(VSSA_D11) 69(VSSA_D12) 70(VSSA_D13) 71(VSSA_D14) 72(VSSA_D15) 73(NC_D16) 74(GDB_GO02_D17) 75(GPIO_01_D18) 76(GPIO_00_D19) 77(USB3XO_E1) 78(USB3Xi_E2) 79(VSSA_E3) 80(NC_E4) 81(VSSA_E5) 82(VSSA_E6) 83(VSSA_E7) 84(VSSA_E8) 85(VSSA_E9) 86(VSSA_E10) 87(VSSA_E11) 88(VSSA_E12) 89(VSSA_E13) 90(VSSA_E14) 91(NC_E15) 92(NC_E16) 93(GDBGO12_E17) 94(USBPE0_E18) 95(USBOC0_E19) 96(VSSA_F1) 97(NC_F2) 98(VSSA_F3) 99(USB3_REX_TP_F4) 100(VSSA_F5) 101(VSSA_F6) 102(VSSA_F7) 103(VCCA10_U4_F8) 104(VCCA10_U4_F9) 105(NC_F10) 106(NC_F11) 107(VCCA_DP_F12) 108(VSSA_F13) 109(VSSA_F14) 110(GDBGO11_F15) 111(NC_F16) 112(GDBGO01_F17) 113(USB_PE3_F18) 114(USB_OC3_F19) 115(DP_G1) 116(DM_G2) 117(VSSA_G3) 118(VSSA_G4) 119(VSSA_G5) 120(VSSA_G6) 121(VSSA_G7) 122(VSSA_G8) 123(VSSA_G9) 124(VSSA_G10) 125(VSSA_G11) 126(VCCA_DP_G12) 127(VSSA_G13) 128(VSSA_G14) 129(GDBGO_00_G15) 130(NC_G16) 131(GDBGO_03_G17) 132(USB_PE4_G18) 133(USB_OC4_G19) 134(DP_E_H1) 135(DM_E_H2) 136(VSSA_H3) 137(VCCAH_M_H4) 138(VSSA_H5) 139(VSSA_H6) 143(NC_H10) 145(VSSA_H12) 146(VSSA_H13) 147(VCCAH_DP_H14) 148(NC_H15) 149(NC_H16) 150(GDBGO04_H17) 151(USBPE5_H18) 152(USBOE5_H19) 153(DP_D_J1) 154(DM_D_J2) 155(VSSA_J3) 156(VCCAH_U4_J4) 157(VSSA_J5) 158(VCCA10_M_J6) 159(VSSA_J7) 160(VSSA_J8) 161(VSSA_J9) 162(VSSA_J10) 163(VSSA_J11) 164(VSSA_J12) 165(VSSA_J13) 166(NC_J14) 167(NC_J15) 168(NC_J16) 169(GDBGO_05_J17) 170(USB_LED_2/SPI_CK_J18) 171(USB_LED_1/SPI_SI_J19) 172(VSSA_K1) 173(VSSA_K2) 174(NC_K3) 175(NC_K4) 176(VSSA_K5) 177(VSSA10_U2_K6) 178(VSSA_K7) 183(VSSA_K12) 184(VCC33_K13) 185(NC_K14) 186(GDBGO_13_K15) 187(NC_K16) 188(GDBGO_16_K17) 189(SPI_CS_K18) 190(USB_LED3/SPI_SO_K19) 191(DP_C_L1) 192(DP_C_L2) 193(VSSA_L3) 194(VCCAH_U2_L4) 195(VSSA_L5) 196(NC_L6) 197(VSSA_L7) 202(VSSA_L12) 203(VCC33_L13) 204(VSSA_L14) 205(GDBGO_14_L15) 206(NC_L16) 207(GPI_L17) 208(VSSA_L18) 209(L19) 210(DP_B_M1) 211(DM_B_M2) 212(VSSA_M3) 213(VCCAH_L34_M4) 214(VSSA_M5) 215(NC_M6) 216(NC_M7) 217(VSSA_M8) 218(VSSA_M9) 219(VSSA_M10) 220(VSSA_M11) 221(NC_M12) 222(VSSA_M13) 223(VSSA_M14) 224(GDBGO_15_M15) 225(NC_M16) 226(VBUSDET0_M17) 227(RESET__M18) 228(TESTEN__M19) 229(DP_A__N1) 230(DM_A__N2) 231(VSSA__N3) 232(VSSA__N4) 233(VSSA__N5) 234(VCCA10_L34_N6) 235(VSSA_N7) 240(VSSA_N12) 241(VCCA10_L12_N13) 242(VCCA10_L12_N14) 243(VSSA_N15) 244(NC_N16) 245(GDBGO07_N17) 246(GPIO02_N18) 247(GPIO03_N19) 248(VSSA_P1) 249(VSSA_P2) 250(VSSA_P3) 251(VSSA_P4) 252(VSSA_P5) 253(VCCA10_L34_P6) 254(VSSA_P7) 255(NC_P8) 256(VCCA01_L34_P9) 257(NC_P10) 258(VSSA_P11) 259(VSSA_P12) 260(NC_P13) 261(VSSA_P14) 262(NC_P15) 263(NC_P16) 264(GDBGO08_P17) 265(USBPE1_P18) 266(USBOC1_P19) 267(USB3TN4_R1) 268(USB3TP4_R2) 269(VSSA_R3) 270(VSSA_R4) 271(VSSA_R5) 272(VSSA_R6) 273(VSSA_R7) 274(VSSA_R8) 275(VSSA_R9) 276(VSSA_R10) 277(VSSA_R11) 278(VSSA_R12) 279(VSSA_R13) 280(VSSA_R14) 281(VCCAH_L12_R15) 282(NC_R16) 283(GDBGO_09_R17) 284(USBPE2_R18) 285(USBOC2_R19) 286(VSSA_T1) 287(VSSA_T2) 288(VSSA_T3) 289(VSSA_T4) 290(VSSA_T5) 291(VSSA_T6) 292(VSSA_T7) 293(VSSA_T8) 294(VSSA_T9) 295(VSSA_T10) 296(VSSA_T11) 297(VSSA_T12) 298(VSSA_T13) 299(VSSA_T14) 300(VSSA_T15) 301(NC_T16) 302(GDBGO10_T17) 303(GPIO05_T18) 304(GPIO04_T19) 305(USB3_RP4_U1) 306(USB3_RN4_U2) 307(VSSA_U3) 308(VSSA_U4) 309(VSSA_U5) 310(VSSA_U6) 311(VSSA_U7) 312(VSSA_U8) 313(VSSA_U9) 314(VSSA_U10) 315(VSSA_U11) 316(VSSA_U12) 317(VSSA_U13) 318(VSSA_U14) 319(VSSA_U15) 320(VSSA_U16) 321(VSSA_U17) 322(GPIO07_U18) 323(GPIO06_U19) 324(VSSA_V1) 325(VSSA_V2) 326(VSSA_V3) 327(USB3RN3_V4) 328(VSSA_V5) 329(USB3_RP2_A_V6) 330(USB3_RP2_B_V7) 331(VSSA_V8) 332(USB3TP2_A_V9) 333(USB3TP2_B_V10) 334(VSSA_V11) 335(USB3TP1_A_V12) 336(USB3TP1_B_V13) 337(VSSA_V14) 338(USB3RP1_A_V15) 339(USB3RP1_B_V16) 340(VSSA_V17) 341(USBLED4_V18) 342(GPIO08_V19) 343(USB3TN3_W1) 344(USB3TP3_W2) 345(VSSA_W3) 346(USB3RP3_W4) 347(VSSA_W5) 348(USB3RN2_A_W6) 349(USB3RN2_B_W7) 350(VSSA_W8) 351(USB3TN2_A_W9) 352(USB3TN2_B_W10) 353(VSSA_W11) 354(USB3RN1_A_W12) 355(USB3RN1_B_W13) 356(VSSA_W14) 357(USB3RN1_A_W15) 358(USB3RN1_B_W16) 359(VSSA_W17) 360(USB4TMU_CLKO_W18) 361(USB4TMU_CLKI_W19); U13 2(PC13-TAMPER-RTC) 3(PC14-OSC32_IN) 4(PC15-OSC32_OUT) 10(PA0_WKUPUSART2_CTSADC12_IN0TIM2_CH1_ETR) 11(PA1USART2_RTSADC12_IN1TIM2_CH2) 12(PA2USART2_TXADC12_IN2TIM2_CH3) 13(PA3USART2_RXADC12_IN3TIM2_CH4) 14(PA4SPI1_NSSUSART2_CKADC12_IN4) 17(PA7SPI1_MOSIADC12_IN7TIM3_CH2) 19(PB1ADC12_IN9TIM3_CH4) 20(PB2BOOT1) 21(PB10I2C2_SCLUSART3_TX) 22(PB11I2C2_SDAUSART3_RX-) 25(PB12SPI2_NSSI2C2_SMBAUSART3_CKTIM1_BKIN) 27(PB14SPI2_MISOUSART3_RTSTIM1_CH2N) 29(PA8USART1_CKTIM1_CH1MCO) 38(PA15JTDI) 41(PB5I2C1_SMBA) 42(PB6I2C1_SCLTIM4_CH1) 43(PB7I2C1_SDATIM4_CH2) 45(PB8TIM4_CH3) 46(PB9TIM4_CH4); U14 4(NC); USBC1 1(SHIELD) 2(SHIELD) 3(SHIELD) 4(SHIELD) A5(CC1) B5(CC2)

## Notes on the sheets
sheet 1
- USB_c8t6
- 复位
- stm32f103c8t6
- 电源稳压
- 外部晶振
- 8MHz
- Power
